# EAGLE design PIC32DIP (EAGLE 6.1)
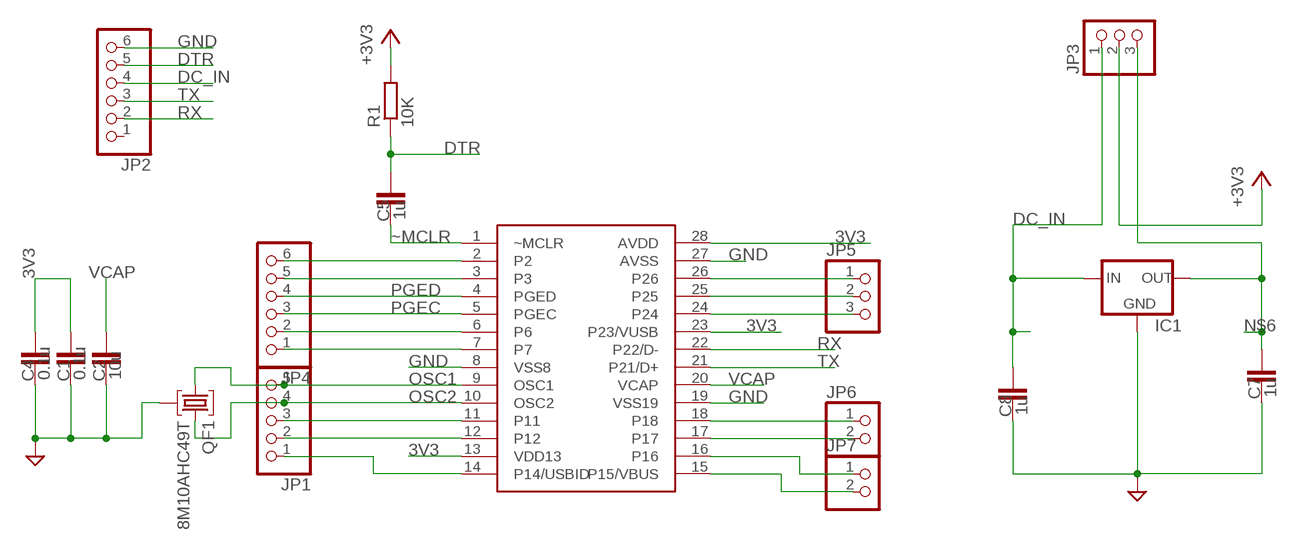
[diagram p0: schematic, sheet 1]

## Parts
C1  0.1u  CAPC805  [C805]
C2  10u  CAPC805  [C805]
C4  0.1u  CAPC805  [C805]
C5  1u  CAPC805  [C805]
C7  1u  CAPC1206  [C1206]
C8  1u  CAPC805  [C805]
IC1  MCP1700_SOT-89-ROUND  [SOT89]
JP1  PINHD-1X5  [1X05]
JP2  PINHD-1X6/90  [1X06/90]
JP3  PINHD-1X3  [1X03]
JP4  PINHD-1X6  [1X06]
JP5  PINHD-1X3  [1X03]
JP6  PINHD-1X2  [1X02]
JP7  PINHD-1X2  [1X02]
QF1  8M10AHC49T  [HC49U]
R1  10K  R-EU_0204/7  [0204/7]
U$1  PIC32DIP  [SOCKET-28-3]

## Nets
3V3: C1.1 C4.1 JP3.2 R1.2 U$1.13(VDD13) U$1.23(P23/VUSB) U$1.28(AVDD) ; supply symbol labelled +3V3
DC_IN: C8.1 IC1.2(IN) IC1.4(IN) JP2.4 JP3.1
DTR: C5.1 JP2.5 R1.1
GND: C1.2 C2.2 C4.2 C7.2 C8.2 IC1.1(GND) JP2.6 QF1.2 U$1.8(VSS8) U$1.19(VSS19) U$1.27(AVSS)
N$1: JP4.6 U$1.2
N$2: JP4.5 U$1.3
N$3: JP4.2 U$1.6
N$4: JP4.1 U$1.7
N$5: JP1.3 U$1.11
N$6: C7.1 IC1.3(OUT) JP3.3
N$7: JP1.2 U$1.12
N$8: JP1.1 U$1.14(P14/USBID)
N$9: JP7.1 U$1.16
N$10: JP6.2 U$1.17
N$11: JP6.1 U$1.18
N$12: JP5.1 U$1.26
N$13: JP5.2 U$1.25
N$14: JP5.3 U$1.24
OSC1: JP1.5 QF1.1 U$1.9(OSC1)
OSC2: JP1.4 QF1.3 U$1.10(OSC2)
PGEC: JP4.3 U$1.5(PGEC)
PGED: JP4.4 U$1.4(PGED)
RX: JP2.2 U$1.22(P22/D-)
TX: JP2.3 U$1.21(P21/D+)
VBUS: JP7.2 U$1.15(P15/VBUS)
VCAP: C2.1 U$1.20(VCAP)
~MCLR: C5.2 U$1.1(~MCLR)
Unconnected: JP2.1

## Library data of the parts
C1 C2 C4 C5 C7 C8 = dp_devices:CAP
IC1 = _MY_OWN_LIB:MCP1700: VOLTAGE REGULATOR
JP1 = pinhead:PINHD-1X5: PIN HEADER
JP2 JP4 = pinhead:PINHD-1X6: PIN HEADER
JP3 JP5 = pinhead:PINHD-1X3: PIN HEADER
JP6 JP7 = pinhead:PINHD-1X2: PIN HEADER
QF1 = crystal:8M10AHC49T: Monolithic Crystal Filters Source: www.vanlong.com; OC_FARNELL: unknown; OC_NEWARK: unknown
R1 = rcl:R-EU_: RESISTOR, European symbol
U$1 = fica2:PIC32DIP

## Board
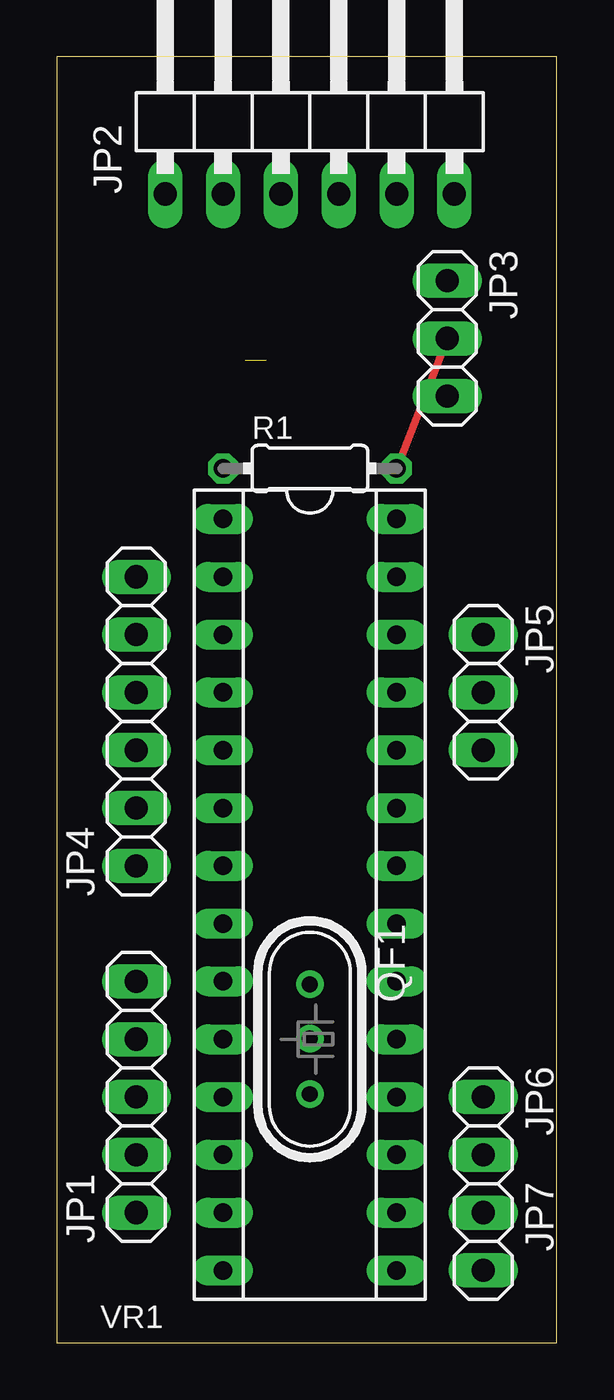
[diagram p1: board, top side]
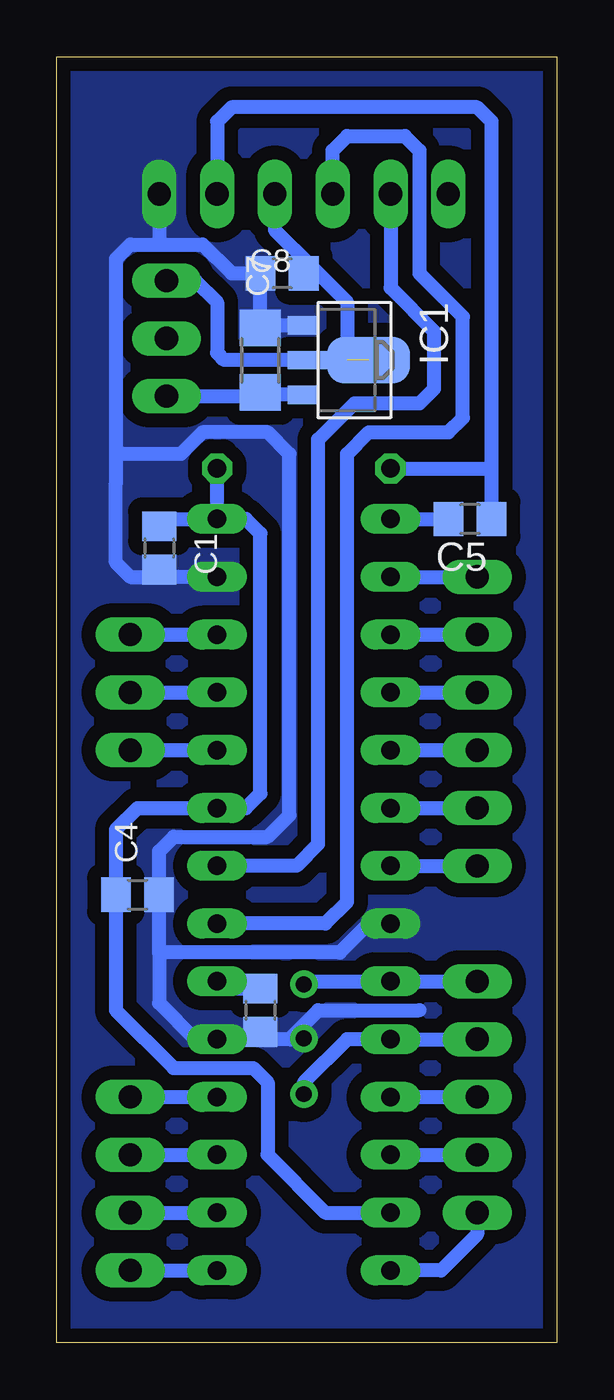
[diagram p2: board, bottom side, seen from below]

Size 21.96 x 56.51 mm. Coordinates in mm from the lower left corner, seen from the top.
Outline: 0,0 21.96,0 21.96,56.51 0,56.51 0,0
Copper layers (1*16): Top 0.035mm / dielectric 1.5mm / Bottom 0.035mm
Design rules: minimum track width 6mil, minimum drill 12mil, track to track 6mil, track to pad 6mil, pad to pad 6mil, via to via 6mil, smd to smd 0mil, copper to edge 10mil, drill to drill 10mil, minimum pad ring 10mil, minimum via ring 6mil, stop-mask expansion 2mil, vias tented up to drill 100mil, thermal gap 10mil

### Footprints (pad centres in the part's own frame; a part is rotated, then mirrored left to right if it is on the bottom)
C805 = smd 1.3 x 1.5: 1 -0.95,0; 2 0.95,0
C1206 = smd 1.6 x 1.803: 1 -1.422,0; 2 1.422,0
SOT89 = smd 0.8 x 1.4: 1 -1.524,-1.905; 3 1.524,-1.905 | smd 0.8 x 1.9: 2 0,-1.651 | smd 2.032 x 3.65: 4 0,0.94
1X05 = drill 1.016 long: 1 -5.08,0; 2 -2.54,0; 3 0,0; 4 2.54,0; 5 5.08,0
1X06/90 = drill 1.016 long: 1 -6.35,-3.81; 2 -3.81,-3.81; 3 -1.27,-3.81; 4 1.27,-3.81; 5 3.81,-3.81; 6 6.35,-3.81
1X03 = drill 1.016 long: 1 -2.54,0; 2 0,0; 3 2.54,0
1X06 = drill 1.016 long: 1 -6.35,0; 2 -3.81,0; 3 -1.27,0; 4 1.27,0; 5 3.81,0; 6 6.35,0
1X02 = drill 1.016 long: 1 -1.27,0; 2 1.27,0
HC49U = drill 0.7 pad 1.2: 1 -2.413,0; 2 -0.027,0; 3 2.413,0
0204/7 = drill 0.813 octagon: 1 -3.81,0; 2 3.81,0
SOCKET-28-3 = drill 0.813 long: 1 -16.51,-3.81; 2 -13.97,-3.81; 3 -11.43,-3.81; 4 -8.89,-3.81; 5 -6.35,-3.81; 6 -3.81,-3.81; 7 -1.27,-3.81; 8 1.27,-3.81; 9 3.81,-3.81; 10 6.35,-3.81; 11 8.89,-3.81; 12 11.43,-3.81; 13 13.97,-3.81; 14 16.51,-3.81; 15 16.51,3.81; 16 13.97,3.81; 17 11.43,3.81; 18 8.89,3.81; 19 6.35,3.81; 20 3.81,3.81; 21 1.27,3.81; 22 -1.27,3.81; 23 -3.81,3.81; 24 -6.35,3.81; 25 -8.89,3.81; 26 -11.43,3.81; 27 -13.97,3.81; 28 -16.51,3.81

### Placement (x,y rotation side)
C1  17.46,34.93 270 bottom
C2  13.02,14.61 270 bottom
C4  18.41,19.68 0 bottom
C5  3.81,36.2 180 bottom
C7  13.02,43.18 90 bottom
C8  12.06,46.99 180 bottom
IC1  9.21,43.18 270 bottom
JP1  3.49,10.79 90 top
JP2  11.11,54.29 0 top
JP3  17.14,44.13 270 top
JP4  3.49,27.3 90 top
JP5  18.73,28.57 270 top
JP6  18.73,9.53 270 top
JP7  18.73,4.45 270 top
QF1  11.11,13.34 270 top
R1  11.11,38.42 0 top
U$1  11.11,19.68 270 top

### Tracks (layer width: path | path; a pad name or v marks a point on that pad's centre or on a via)
3V3
  Top 0.305: JP3.2 R1.2
  Bottom 0.61: U$1.13 10.16,5.71 12.7,8.26 12.7,11.43 13.34,12.06 16.83,12.06 19.36,14.6 C4.1 19.36,22.54 18.41,23.49 U$1.23 13.65,23.49 13.02,24.13 13.02,35.56 13.65,36.2 U$1.28 | C1.1 17.46,36.19 15.88,36.2 U$1.28 | U$1.28 R1.2
DC_IN  (1 unrouted)
  Bottom 0.61: JP3.1 15.88,46.67 14.92,45.72 14.92,43.5 14.61,43.18 IC1.2 IC1.4 | JP2.4 12.38,48.9 10.79,47.31 | C8.1 10.79,47.31 | 10.79,47.31 9.21,45.72 9.21,43.18
DTR
  Bottom 0.61: JP2.5 14.92,53.66 14.29,54.29 3.49,54.29 2.86,53.66 C5.1 2.86,38.41 2.86,38.42 R1.1
GND
  Bottom 0.61: U$1.27 17.46,33.66 C1.2 17.46,33.66 18.73,33.66 19.36,34.29 19.36,37.78 19.37,37.78 19.36,37.79 19.36,39.05 | U$1.8 8.26,18.41 9.53,17.14 17.46,17.14 | 17.46,17.14 C4.2 | C4.2 17.46,21.59 16.83,22.22 12.7,22.22 11.75,23.18 11.75,39.05 12.7,40.01 15.56,40.01 16.51,39.05 19.36,39.05 | IC1.1 12.92,44.7 C7.2 C8.2 14.29,46.99 15.56,48.26 17.46,48.26 | 19.36,39.05 19.36,42.87 19.37,42.86 19.37,47.62 18.73,48.26 17.46,48.26 | JP2.6 17.46,48.26 | 17.46,17.14 17.46,14.92 15.88,13.34 U$1.19 13.02,13.34 | 6.03,14.61 10.48,14.61 11.43,13.65 | 11.43,13.65 11.75,13.34 | 11.75,13.34 13.02,13.34 | QF1.2 11.14,13.36 11.43,13.65 | C4.2 17.78,19.68 C4.2 | C2.2 13.02,13.34 | 11.75,13.34 11.43,13.34
  pour Bottom (isolate 0.61, no thermals): 0,0 21.91,0 21.91,56.52 0,56.52
N$1
  Bottom 0.61: U$1.2 JP4.6
N$2
  Bottom 0.61: U$1.3 JP4.5
N$3
  Bottom 0.61: U$1.6 JP4.2
N$4
  Bottom 0.61: U$1.7 JP4.1
N$5
  Bottom 0.61: U$1.11 JP1.3
N$6
  Bottom 0.61: IC1.3 13.02,41.66 C7.1 13.02,41.59 | 13.08,41.66 13.02,41.59 | JP3.3 13.02,41.59
N$7
  Bottom 0.61: U$1.12 JP1.2
N$8
  Bottom 0.61: JP1.1 3.49,4.76 5.08,3.17 U$1.14
N$9
  Bottom 0.61: JP7.1 U$1.16
N$10
  Bottom 0.61: JP6.2 U$1.17
N$11
  Bottom 0.61: JP6.1 U$1.18
N$12
  Bottom 0.61: JP5.1 U$1.26
N$13
  Bottom 0.61: JP5.2 U$1.25
N$14
  Bottom 0.61: JP5.3 U$1.24
OSC1
  Bottom 0.61: JP1.5 U$1.9 11.11,15.88 QF1.1
OSC2
  Bottom 0.61: JP1.4 U$1.10 9.21,13.34 11.11,11.43 QF1.3
PGEC
  Bottom 0.61: U$1.5 JP4.3
PGED
  Bottom 0.61: U$1.4 JP4.4
RX
  Bottom 0.61: U$1.22 11.43,20.95 10.48,21.91 10.48,39.69 8.89,41.27 6.03,41.27 5.4,41.91 5.4,44.45 7.3,46.36 JP2.2
TX
  Bottom 0.61: JP2.3 9.84,52.39 9.21,53.02 6.67,53.02 6.03,52.39 6.03,46.99 4.13,45.09 4.13,40.64 4.76,40.01 8.26,40.01 9.21,39.05 9.21,19.37 10.16,18.41 U$1.21
VBUS
  Bottom 0.61: JP7.2 U$1.15
VCAP
  Bottom 0.61: C2.1 14.6,15.56 U$1.20
~MCLR
  Bottom 0.61: U$1.1 C5.2

### Text on the board
tNames: VR1